# Altium schematic sheet LegoPCB.SchDoc
size A; SheetNumber: 1; SheetTotal: 1
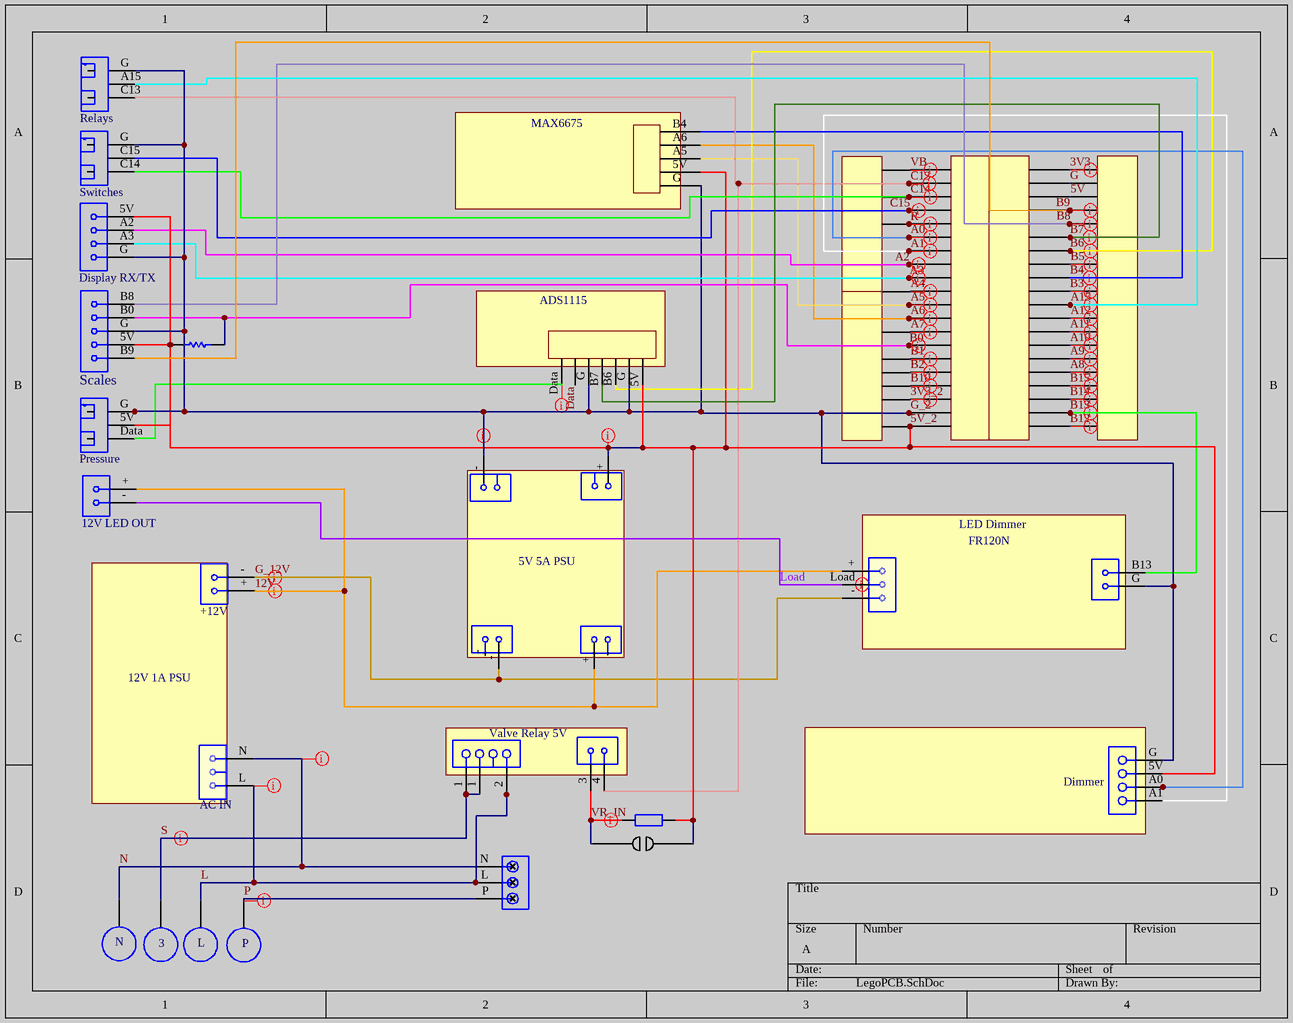
[diagram p0: LegoPCB.SchDoc]

## Parts
CON1  Sullins PPPC201LFBN-RC  [Sullins PPPC201LFBN-RC-Footprint-1]  (value not drawn)
CON2  Sullins PPPC201LFBN-RC  [Sullins PPPC201LFBN-RC-Footprint-1]  (value not drawn)
J1  MAX6675  [PCB-c8wxqbpuztdqlisz61jd-1]
J2  N  [PCB-lmo4cvcrd3hgu4lqjal6-1]
J3  Phoenix Contact 1725737  [PCB-8mrs26jb0m74f5547pgl-1]  (value not drawn)
J4  Phoenix Contact 1725737  [PCB-8mrs26jb0m74f5547pgl-1]  (value not drawn)
J5  Phoenix Contact 1725737  [PCB-8mrs26jb0m74f5547pgl-1]  (value not drawn)
J6  Phoenix Contact 1725737  [PCB-8mrs26jb0m74f5547pgl-1]  (value not drawn)
J7  Display RX/TX  [PCB-v4lpv01b3d9u6onk6w5a-1]
J8  L  [PCB-lmo4cvcrd3hgu4lqjal6-1]
J10  12V LED OUT  [PCB-pp1at3pfx7vls1ur72ey-1]
J11  Pressure  [PCB-s1nk6bx8e0uhgoyi2lp0-1]
J12  ADS1115  [PCB-djj3bheceme2fk260ej0-1]
J13  3  [PCB-lmo4cvcrd3hgu4lqjal6-1]
J14  P  [PCB-lmo4cvcrd3hgu4lqjal6-1]
J15  Switches  [PCB-s1nk6bx8e0uhgoyi2lp0-1]
J16  Relays  [PCB-s1nk6bx8e0uhgoyi2lp0-1]
J17  Scales  [PCB-dzjuchh7p1ijerjijdkb-1]
JP1  LED Dimmer  [PCB-kugy9kjyf34z14v4pi0o-1]
JP2  -  [PCB-kugy9kjyf34z14v4pi0o-1]  (value not drawn)
JP3  +  [PCB-kugy9kjyf34z14v4pi0o-1]  (value not drawn)
JP4  LED Out  [PCB-nkeji9tp65z457ob3842-1]  (value not drawn)
JP6  +12V  [PCB-kugy9kjyf34z14v4pi0o-1]
JP7  +  [PCB-kugy9kjyf34z14v4pi0o-1]  (value not drawn)
JP8  -  [PCB-kugy9kjyf34z14v4pi0o-1]  (value not drawn)
JP9  AC IN  [PCB-nkeji9tp65z457ob3842-1]
JP10  Relay  [PCB-kugy9kjyf34z14v4pi0o-1]  (value not drawn)
K2  OSTTC032162 On Shore Technology  [SCREW-3-0.2]  (value not drawn)
K3  Valve Relay 5V  [PCB-ahml74j8rqsm8wocvo1r-1]
K5  Dimmer  [PCB-ahml74j8rqsm8wocvo1r-1]
R1  330Ω  [PCB-lbgq4d8jpobhtdbabtzs-1]  (value not drawn)
R2  1kΩ  [PCB-lbgq4d8jpobhtdbabtzs-1]  (value not drawn)
SB1  R1 Bypass  [PCBComponent_1 - duplicate]  (value not drawn)

## Blocks framed on the sheet
5V 5A PSU: JP2 JP3 JP7 JP8
FR120N: JP1 JP4
12V 1A PSU: JP9

## Nets
3V3: CON2.40 J5.40
3V3_2: CON1.18 J3.18
5V: CON2.38 J5.38
5V_2: CON1.20 J1.5V J3.20 J7.5V J11.5V J12.5V J17.5V JP7.+ K5.5V R1.2 R2.2 SB1.2
12V: J10.+ JP3.+ JP4.+ JP6.+
A0: CON1.6 J6.6 K5.A0
A1: CON1.7 J6.7 K5.A1
A2: CON1.8 J6.8 J7.A2
A3: CON1.9 J6.9 J7.A3
A4: CON1.10 J6.10
A5: CON1.11 J1.A5 J3.11
A6: CON1.12 J1.A6 J3.12
A7: CON1.13 J3.13
A8: CON2.25 J4.25
A9: CON2.26 J4.26
A10: CON2.27 J4.27
A11: CON2.28 J4.28
A12: CON2.29 J4.29
A15: CON2.30 J4.30 J16.A15
B0: CON1.14 J3.14 J17.B0 R2.1
B1: CON1.15 J3.15
B2: CON1.16 J3.16
B3: CON2.31 J5.31
B4: CON2.32 J1.B4 J5.32
B5: CON2.33 J5.33
B6: CON2.34 J5.34 J12.B6
B7: CON2.35 J5.35 J12.B7
B8: CON2.36 J5.36 J17.B8
B9: CON2.37 J5.37 J17.B9
B10: CON1.17 J3.17
B12: CON2.21 J4.21
B13: CON2.22 J4.22 JP1.B13
B14: CON2.23 J4.23
B15: CON2.24 J4.24
C13: CON1.2 J6.2 J16.C13 JP10.4
C14: CON1.3 J6.3 J15.C14
C15: CON1.4 J6.4 J15.C15
Data: J11.Data J12.Data
G: CON2.39 J5.39
G_2: CON1.19 J1.G J3.19 J7.G J11.G J12.G J15.G J16.G J17.G JP1.G JP2.- K5.G
G_12V: JP4.- JP6.- JP8.-
L: J8.L JP9.L K2.L K3.2
Load: J10.- JP4.Load
N: J2.N JP9.N K2.N
P: J14.P K2.P
R: CON1.5 J6.5
S: J13.3 K3.1
VB: CON1.1 J6.1
VR_IN: JP10.3 R1.1 SB1.1

Not connected (* = marked no-connect by the designer): J12 6

## Layout directives
rule Width Constraint [Pref Width = 0.5mm    Min Width = 0.254mm    Max Width = 1mm]; net class 12V: 12V, G_12V, Load
AC: Undefined; rule Width Constraint [Pref Width = 1mm    Min Width = 0.254mm    Max Width = 1mm]; net class AC: L, S
5V: Undefined; rule Width Constraint [Pref Width = 0.5mm    Min Width = 0.254mm    Max Width = 0.5mm]; net class 5V: 5V_2
5V: Undefined; rule Width Constraint [Pref Width = 0.254mm    Min Width = 0.254mm    Max Width = 0.254mm]: G_2
Signal: Undefined; rule Width Constraint [Pref Width = 0.254mm    Min Width = 0.254mm    Max Width = 0.254mm]; net class Signal: 3V3, 3V3_2, A0, A1, A2, A3, A4, A5, A6, A7, A8, A9, A10, A11, A12, A15, B0, B1, B2, B3, B4, B5, B6, B7, B8, B9, B10, B12, B13, B14, B15, C13, C14, C15, Data, R, VB, VR_IN
AC: Undefined; rule Width Constraint [Pref Width = 2mm    Min Width = 0.254mm    Max Width = 2mm]; net class AC: N, P

## Library data of the parts
CON1 CON2 = CMP-9b20522e9c9b44e7-4: 20 Position Total Single Row 2.54 mm Pitch Straight Female Header; Pin Pitch: 2.54 mm; Lead-Free Status: Lead Free; Number of Positions: 20; RoHS: Compliant; Color: Black; Size-Height: 8.50 mm; Contact Material: Phosphor Bronze; Size-Width: 2.54 mm; Packaging: Bulk; Manufacturer Part Number: PPPC201LFBN-RC; Mounting Style: Through Hole; Housing Material: Plastic; Contact Plating: Gold; OctopartID: 9b20522e9c9b44e7; Size-Length: 51.3 mm; Number of Rows: 1; Octopart Url: https://octopart.com/pppc201lfbn-rc-sullins-271069; Operating Temperature: 105 °C (max)
J1 = CMP-4c2785294be693e0-3: 5 Position Total Single Row 2.54 mm Pitch Straight Female Header
J2 J8 J13 J14 = CMP-417e8a2f0d709eb9-4: Quick Disconnect Terminal M 13.63mm 7.92mm Tin Over Copper/Tin Over Nickel Strip
J3-J6 = CMP-7b98b2926a9ca45f-4: Micro Printed With Ic Pitch 10pos 6a 63vac 26-20awg Green Plastic Housing 2.54mm Pitch 22.86mm Length; Lead-Free Status: Lead Free; Number of Contacts: 10; Housing Material: Nylon 6/6; Size-Height: 8.50 mm; Pin Pitch: 2.54 mm; Size-Length: 25.9 mm; Housing Color: Green; Octopart URL: https://octopart.com/1725737-phoenix+contact-13410; Mounting Style: Screw, Through Hole, PCB; Flammability Rating: UL 94 V-0; Color: Green; Insulation Material: Nylon; Number of Rows: 1; Manufacturer Part Number: 1725737; Number of Positions: 10; OctopartID: 7b98b2926a9ca45f; Size-Width: 6.20 mm; RoHS: Compliant
J7 = CMP-f47a3d4c33a92bbd-6: Conn Shrouded Header HDR 4 POS 2.5mm Solder ST Thru-Hole Box; Manufacturer Part Number: B4B-XH-A; Octopart URL: https://octopart.com/b4b-xh-a-jst-3990197; Orientation: Straight; OctopartID: f47a3d4c33a92bbd; Contact Material: Phosphor Bronze
J10 = CMP-1d67d451da9ec2a0-5: Conn Shrouded Header HDR 2 POS 2.5mm Solder ST Thru-Hole Box; Manufacturer Part Number: B2B-XH-A; OctopartID: 1d67d451da9ec2a0; Orientation: Straight; Contact Material: Phosphor Bronze; Octopart URL: https://octopart.com/b2b-xh-a-jst-3990175
J11 J15 J16 = CMP-a0e069d6672e7f27-2: Conn Shrouded Header HDR 3 POS 2.5mm Solder ST Thru-Hole Box; Manufacturer Part Number: B3B-XH-A; OctopartID: a0e069d6672e7f27; Octopart URL: https://octopart.com/b3b-xh-a-jst-3990184; Contact Material: Phosphor Bronze; Orientation: Straight
J12 = CMP-a14f6841a6867e88-3: Female, 7C, Straight, .100"CC; 3.20mm Tail, No Mt. 100u" Tin; PBT, Phos Bronze, 105 C; Manufacturer Part Number: PPTC071LFBN-RC; Number of Positions: 7; Pin Pitch: 2.54 mm; Lead-Free Status: Lead Free; Size-Length: 18.3 mm; Operating Temperature: 125 °C (max); OctopartID: a14f6841a6867e88; Mounting Style: Through Hole; Contact Material: Phosphor Bronze; Number of Rows: 1; Housing Material: Plastic; Contact Plating: Tin; Size-Height: 8.50 mm; Size-Width: 2.50 mm; Packaging: Bulk; RoHS: Compliant; Color: Black; Octopart URL: https://octopart.com/pptc071lfbn-rc-sullins-271023
J17 = CMP-dd9114a71a480256-1: Conn Shrouded Header HDR 5 POS 2.5mm Solder ST Thru-Hole Box; Manufacturer Part Number: B5B-XH-A; Contact Material: Phosphor Bronze; Octopart URL: https://octopart.com/b5b-xh-a-jst-3990207; OctopartID: dd9114a71a480256; Orientation: Straight
JP1-JP3 JP6-JP8 JP10 = CMP-5b24922a5ce984e3-2: Female, 2C, Straight, .100"CC; 3.20mm Tail, No Mt. 100u" Tin; PBT, Phos Bronze, 105 C; Manufacturer Part Number: PPTC021LFBN-RC; Lead-Free Status: Lead Free; Pin Pitch: 2.54 mm; Number of Positions: 2; Number of Rows: 1; OctopartID: 5b24922a5ce984e3; Contact Material: Phosphor Bronze; Operating Temperature: 125 °C (max); RoHS: Compliant; Size-Height: 8.50 mm; Housing Material: Plastic; Size-Width: 2.50 mm; Size-Length: 5.58 mm; Contact Plating: Tin; Octopart URL: https://octopart.com/pptc021lfbn-rc-sullins-271019; Packaging: Bulk; Color: Black; Mounting Style: Through Hole
JP4 JP9 = CMP-6431ad3f63fbbbf6-3: Female, 3C, Straight, .100"CC; 3.20mm Tail, No Mt. 100u" Tin; PBT, Phos Bronze, 105 C; Manufacturer Part Number: PPTC031LFBN-RC; Number of Positions: 3; Lead-Free Status: Lead Free; Pin Pitch: 2.54 mm; Packaging: Bulk; Size-Width: 2.50 mm; Contact Plating: Tin; Mounting Style: Through Hole; RoHS: Compliant; Color: Black; Size-Height: 8.50 mm; OctopartID: 6431ad3f63fbbbf6; Size-Length: 8.12 mm; Contact Material: Phosphor Bronze; Octopart URL: https://octopart.com/pptc031lfbn-rc-sullins-271020; Housing Material: Plastic; Number of Rows: 1; Operating Temperature: 125 °C (max)
K2 = CMP-6c12a51cf3ddb3d5-2: Connector Terminal Block 3 Position..200" /5.08Mm Spacing Top Screw; Pin Pitch: 5.08 mm; Number of Positions: 3; Lead-Free Status: Lead Free; Flammability Rating: UL 94 V-0; Number of Rows: 1; Mounting Style: Through Hole; Size-Width: 7.60 mm; Contact Material: Brass; Footprint: PCB-6gk9ra20ru7l9v6bd3c9-1; Housing Color: Blue; Size-Height: 10.0 mm; Manufacturer Part Number: OSTTC032162; RoHS: Compliant; Contact Plating: Copper Alloy, Zinc Alloy; Octopart URL: http://octopart.com/osttc032162-on+shore+technology-309929; Color: Blue; Size-Length: 15.2 mm; OctopartID: 6c12a51cf3ddb3d5; Packaging: Bulk; Housing Material: Nylon
K3 K5 = CMP-fc91359ffb3a2356-3: Female, 4 C, Straight, .100"CC; 3.20mm Tail, No Mounting; PBT, Phos. Bronze, 105 C; Manufacturer Part Number: PPPC041LFBN-RC; Number of Positions: 4; Lead-Free Status: Lead Free; Pin Pitch: 2.54 mm; RoHS: Compliant; Mounting Style: Through Hole; Color: Black; Housing Material: Plastic; Octopart URL: https://octopart.com/pppc041lfbn-rc-sullins-271053; OctopartID: fc91359ffb3a2356; Packaging: Bulk; Size-Height: 8.50 mm; Operating Temperature: 105 °C (max); Size-Length: 10.7 mm; Contact Material: Phosphor Bronze; Number of Rows: 1; Contact Plating: Gold; Size-Width: 2.50 mm
R1 = CMP-e3202a2516cc3ce7-1: Res Carbon Film 330 Ohm 5% 0.25W(1/4W) -450ppm/C to 350ppm/C Conformal Coated AXL T/R; Manufacturer Part Number: CF1/4CT52R331J; Power Rating: 250 mW; Voltage Rating (DC): 250 V; OctopartID: e3202a2516cc3ce7; Octopart Url: https://octopart.com/cf1%2F4ct52r331j-koa+speer-1036426; RoHS: Compliant; Packaging: Reel; Resistance: 330 Ω; Operating Temperature: -55.0 °C to 155 °C; Mounting Style: Through Hole
R2 = CMP-d4db1ce18fa80b1c-15: Res Carbon Film 1K Ohm 5% 1/4W -1200ppm/°C to 0ppm/°C Conformal AXL Thru-Hole Ammo Pack; Manufacturer Part Number: CFR16J1K0; Power Rating: 250 mW; Voltage Rating (DC): 200 V; ELV Compliant: Compliant; Resistance: 1.00 kΩ; RoHS: Compliant; Resistance Tolerance: ±5%; Octopart URL: https://octopart.com/cfr16j1k0-te+connectivity-19955221; OctopartID: d4db1ce18fa80b1c; Lifecycle Status: Obsolete; Packaging: Ammo Pack; REACH SVHC Compliance: No SVHC; Operating Temperature: -55.0 °C to 155 °C; Mounting Style: Axial
SB1 = CMP-87564b6aea185891-5: Solder Bridge; OctopartID: 87564b6aea185891; RoHS: Compliant